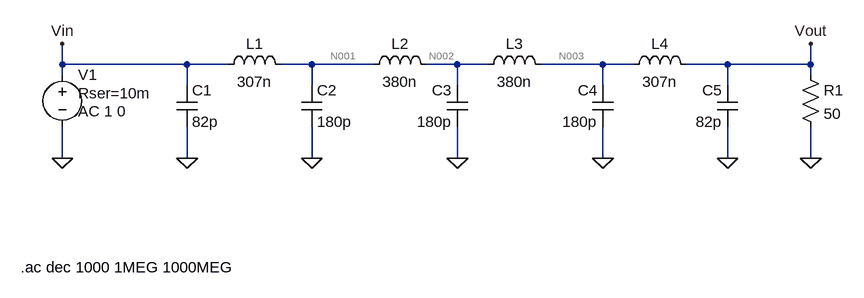
[diagram p0: schematic lowpass.asc]
lowpass.asc, the LTspice schematic file:
Version 4
SHEET 1 1112 680
WIRE -96 80 -96 48
WIRE 96 80 -96 80
WIRE 160 80 96 80
WIRE 288 80 240 80
WIRE 384 80 288 80
WIRE 512 80 464 80
WIRE 560 80 512 80
WIRE 736 80 640 80
WIRE 784 80 736 80
WIRE 928 80 864 80
WIRE 1056 80 1056 48
WIRE 1056 80 928 80
WIRE -96 96 -96 80
WIRE 1056 96 1056 80
WIRE 96 112 96 80
WIRE 288 112 288 80
WIRE 512 112 512 80
WIRE 736 112 736 80
WIRE 928 112 928 80
WIRE -96 224 -96 176
WIRE 96 224 96 176
WIRE 288 224 288 176
WIRE 512 224 512 176
WIRE 736 224 736 176
WIRE 928 224 928 176
WIRE 1056 224 1056 176
FLAG 96 224 0
FLAG 288 224 0
FLAG -96 224 0
FLAG -96 48 Vin
FLAG 1056 48 Vout
FLAG 1056 224 0
FLAG 928 224 0
FLAG 736 224 0
FLAG 512 224 0
SYMBOL cap 80 112 R0
SYMATTR InstName C1
SYMATTR Value 82p
SYMBOL cap 272 112 R0
SYMATTR InstName C2
SYMATTR Value 180p
SYMBOL ind 144 96 R270
WINDOW 0 32 56 VTop 2
WINDOW 3 5 56 VBottom 2
SYMATTR InstName L1
SYMATTR Value 307n
SYMBOL voltage -96 80 R0
WINDOW 3 24 44 Left 2
WINDOW 123 24 72 Left 2
WINDOW 39 24 44 Left 2
SYMATTR Value ""
SYMATTR Value2 AC 1 0
SYMATTR SpiceLine Rser=10m
SYMATTR InstName V1
SYMBOL res 1040 80 R0
SYMATTR InstName R1
SYMATTR Value 50
SYMBOL ind 368 96 R270
WINDOW 0 32 56 VTop 2
WINDOW 3 5 56 VBottom 2
SYMATTR InstName L2
SYMATTR Value 380n
SYMBOL cap 944 112 M0
SYMATTR InstName C5
SYMATTR Value 82p
SYMBOL cap 752 112 M0
SYMATTR InstName C4
SYMATTR Value 180p
SYMBOL ind 880 96 M270
WINDOW 0 32 56 VTop 2
WINDOW 3 5 56 VBottom 2
SYMATTR InstName L4
SYMATTR Value 307n
SYMBOL ind 656 96 M270
WINDOW 0 32 56 VTop 2
WINDOW 3 5 56 VBottom 2
SYMATTR InstName L3
SYMATTR Value 380n
SYMBOL cap 528 112 M0
SYMATTR InstName C3
SYMATTR Value 180p
TEXT -160 392 Left 2 !.ac dec 1000 1MEG 1000MEG

The netlist it stands for:
* lowpass.asc
C1 Vin 0 82p
C2 N001 0 180p
L1 Vin N001 307n
V1 Vin 0 AC 1 0 Rser=10m
R1 Vout 0 50
L2 N001 N002 380n
C5 Vout 0 82p
C4 N003 0 180p
L4 Vout N003 307n
L3 N003 N002 380n
C3 N002 0 180p
.ac dec 1000 1MEG 1000MEG
.backanno
.end

* Results of the author's LTspice run, read from the files saved beside the schematic
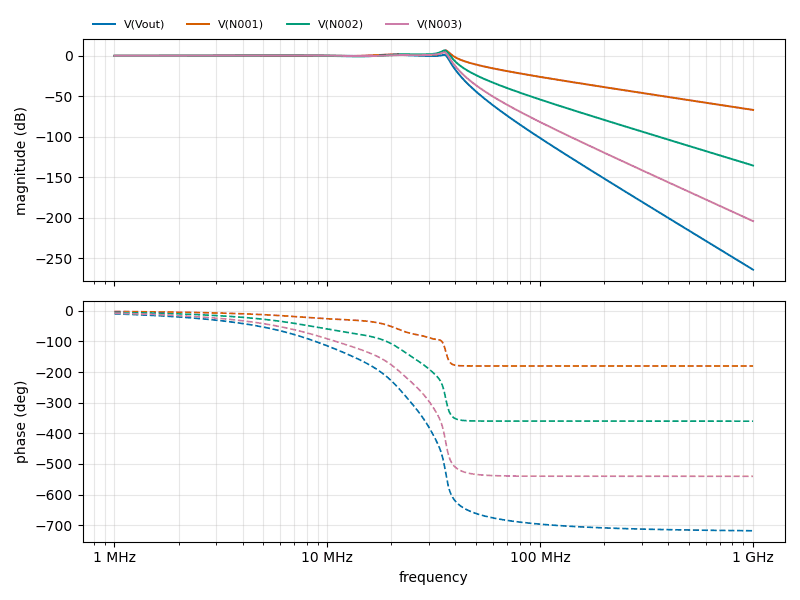
[diagram p1: AC Analysis of lowpass.asc, plotted from the saved traces]
* AC Analysis, 1 run:
*   V(Vout): 0.03 dB at 1 MHz, -263.96 dB at 1 GHz, peak 1.33 dB at 35.32 MHz, 3 dB below the peak at 36.62 MHz
*   V(N001): 0.01 dB at 1 MHz, -66.77 dB at 1 GHz, peak 6.70 dB at 35.89 MHz, 3 dB below the peak at 34.21 MHz and 37.41 MHz
*   V(N002): 0.02 dB at 1 MHz, -135.39 dB at 1 GHz, peak 6.68 dB at 35.65 MHz, 3 dB below the peak at 33.32 MHz and 36.91 MHz
*   V(N003): 0.03 dB at 1 MHz, -204.01 dB at 1 GHz, peak 4.17 dB at 35.48 MHz, 3 dB below the peak at 29.64 MHz and 36.71 MHz